# EAGLE design IN-2 tubes (EAGLE 8.6.0)
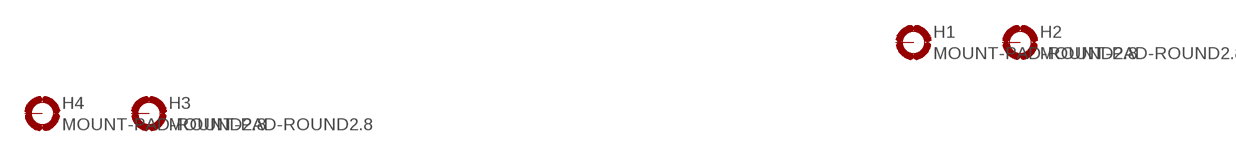
[diagram p0: schematic, sheet 1, part 1 of 2]
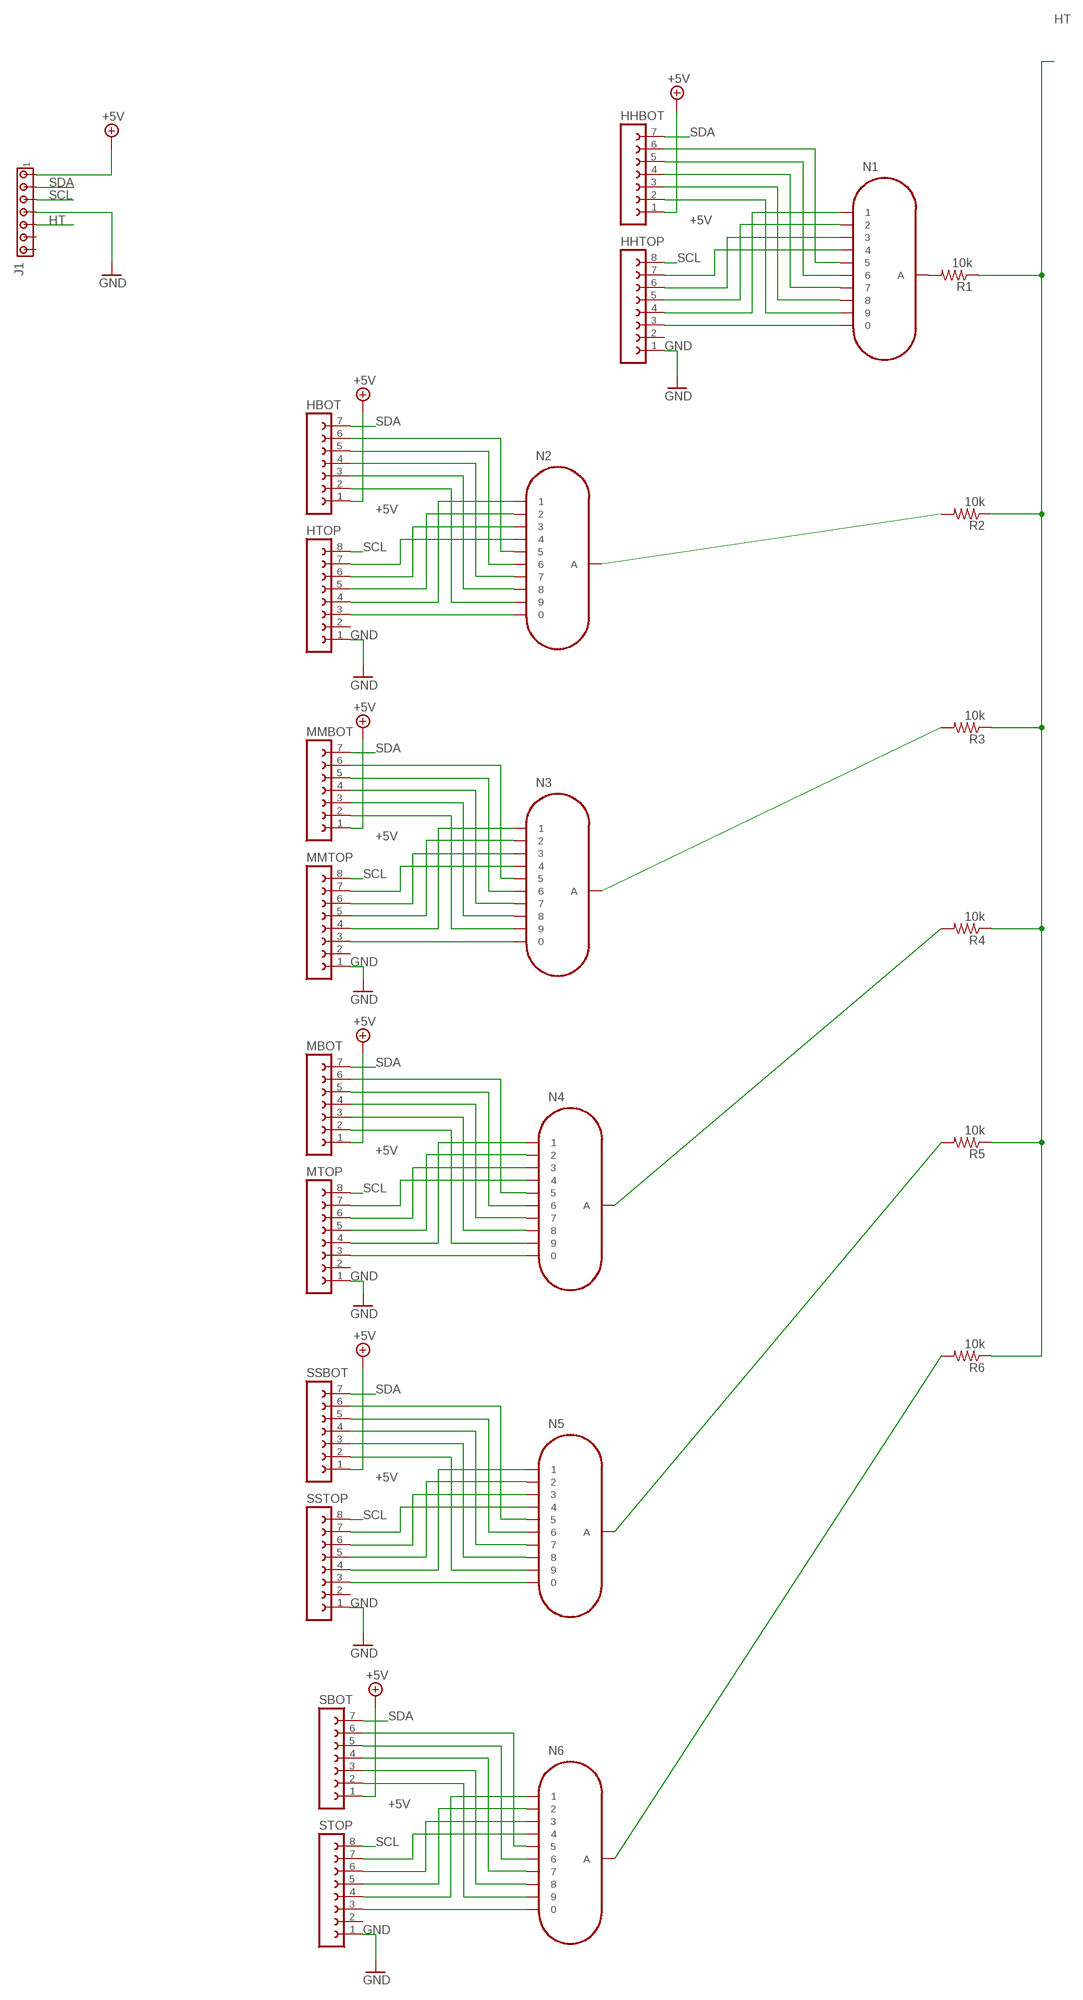
[diagram p1: schematic, sheet 1, part 2 of 2]

## Parts
H1  MOUNT-PAD-ROUND2.8  [2,8-PAD]
H2  MOUNT-PAD-ROUND2.8  [2,8-PAD]
H3  MOUNT-PAD-ROUND2.8  [2,8-PAD]
H4  MOUNT-PAD-ROUND2.8  [2,8-PAD]
HBOT  FE07-1  [FE07]
HHBOT  FE07-1  [FE07]
HHTOP  FE08-1  [FE08]
HTOP  FE08-1  [FE08]
J1  MTA07-100  [10X07MTA]
MBOT  FE07-1  [FE07]
MMBOT  FE07-1  [FE07]
MMTOP  FE08-1  [FE08]
MTOP  FE08-1  [FE08]
N1  IN-2  [IN-8]
N2  IN-2  [IN-8]
N3  IN-2  [IN-8]
N4  IN-2  [IN-8]
N5  IN-2  [IN-8]
N6  IN-2  [IN-8]
R1  10k  R-US_M0805  [M0805]
R2  10k  R-US_M0805  [M0805]
R3  10k  R-US_M0805  [M0805]
R4  10k  R-US_M0805  [M0805]
R5  10k  R-US_M0805  [M0805]
R6  10k  R-US_M0805  [M0805]
SBOT  FE07-1  [FE07]
SSBOT  FE07-1  [FE07]
SSTOP  FE08-1  [FE08]
STOP  FE08-1  [FE08]

## Nets
+5V: HBOT.1 HHBOT.1 J1.1 MBOT.1 MMBOT.1 SBOT.1 SSBOT.1
GND: HHTOP.1 HTOP.1 J1.4 MMTOP.1 MTOP.1 SSTOP.1 STOP.1
HT: J1.5 R1.1 R2.1 R3.1 R4.1 R5.1 R6.1
N$1: HHTOP.3 N1.0
N$2: HHTOP.4 N1.1
N$3: HHTOP.5 N1.2
N$4: HHTOP.6 N1.3
N$5: HHTOP.7 N1.4
N$6: HTOP.3 N2.0
N$7: HTOP.4 N2.1
N$8: HTOP.5 N2.2
N$9: N4.A R4.2
N$10: HTOP.6 N2.3
N$11: HTOP.7 N2.4
N$12: HBOT.6 N2.5
N$13: HBOT.5 N2.6
N$14: N2.A R2.2
N$15: HBOT.4 N2.7
N$16: HBOT.3 N2.8
N$17: N3.A R3.2
N$18: HBOT.2 N2.9
N$19: N6.A R6.2
N$20: N5.A R5.2
N$21: MMTOP.3 N3.0
N$22: N1.A R1.2
N$32: MMTOP.4 N3.1
N$33: MMTOP.5 N3.2
N$34: MMTOP.6 N3.3
N$35: MMTOP.7 N3.4
N$36: MMBOT.6 N3.5
N$37: MMBOT.5 N3.6
N$38: MMBOT.4 N3.7
N$39: MMBOT.3 N3.8
N$40: MMBOT.2 N3.9
N$41: MTOP.3 N4.0
N$42: MTOP.4 N4.1
N$43: MTOP.5 N4.2
N$44: MTOP.6 N4.3
N$45: MTOP.7 N4.4
N$46: MBOT.6 N4.5
N$47: MBOT.5 N4.6
N$48: MBOT.4 N4.7
N$49: MBOT.3 N4.8
N$51: MBOT.2 N4.9
N$52: N5.0 SSTOP.3
N$53: N5.1 SSTOP.4
N$54: N5.2 SSTOP.5
N$55: N5.3 SSTOP.6
N$56: N5.4 SSTOP.7
N$57: N5.5 SSBOT.6
N$58: N5.6 SSBOT.5
N$59: N5.7 SSBOT.4
N$60: N5.8 SSBOT.3
N$61: N5.9 SSBOT.2
N$62: N6.0 STOP.3
N$63: N6.1 STOP.4
N$64: N6.2 STOP.5
N$65: N6.3 STOP.6
N$66: N6.4 STOP.7
N$67: N6.5 SBOT.6
N$68: N6.6 SBOT.5
N$69: N6.7 SBOT.4
N$70: N6.8 SBOT.3
N$71: N6.9 SBOT.2
N$72: HHBOT.6 N1.5
N$73: HHBOT.5 N1.6
N$74: HHBOT.4 N1.7
N$75: HHBOT.3 N1.8
N$76: HHBOT.2 N1.9
SCL: HHTOP.8 HTOP.8 J1.3 MMTOP.8 MTOP.8 SSTOP.8 STOP.8
SDA: HBOT.7 HHBOT.7 J1.2 MBOT.7 MMBOT.7 SBOT.7 SSBOT.7
Unconnected: H1.B2,8(MOUNT) H2.B2,8(MOUNT) H3.B2,8(MOUNT) H4.B2,8(MOUNT) HHTOP.2 HTOP.2 J1.6 J1.7 MMTOP.2 MTOP.2 SSTOP.2 STOP.2

## Library data of the parts
H1-H4 = holes:MOUNT-PAD-ROUND: MOUNTING PAD, round
HBOT HHBOT MBOT MMBOT SBOT SSBOT = con-lsta:FE07-1: FEMALE HEADER; OC_FARNELL: unknown; OC_NEWARK: unknown
HHTOP HTOP MMTOP MTOP SSTOP STOP = con-lsta:FE08-1: FEMALE HEADER; OC_FARNELL: unknown; OC_NEWARK: unknown
J1 = con-amp:MTA07-100: AMP connector
N1-N6 = russian-nixies:IN-2: IN-2: tiny numeric topview nixie tube
R1-R6 = adafruit:R-US_: RESISTOR, American symbol

## Board
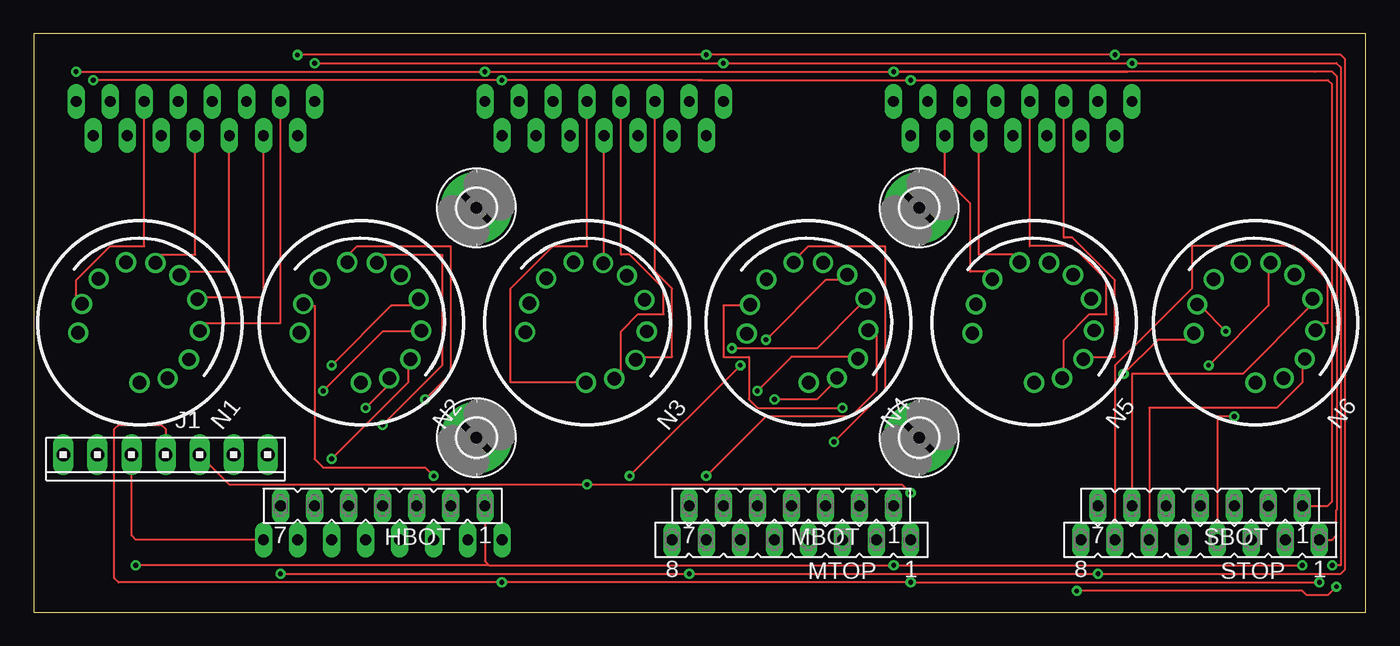
[diagram p2: board, top side]
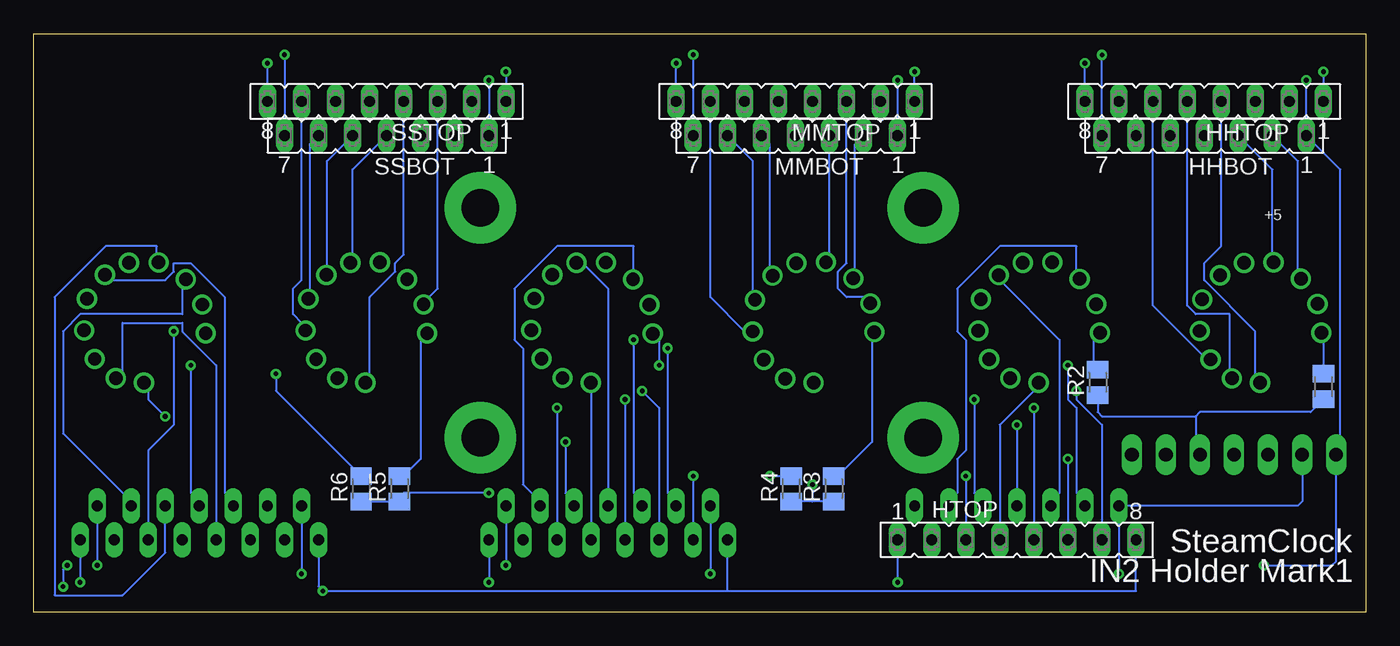
[diagram p3: board, bottom side, seen from below]

Size 99.36 x 43.17 mm. Coordinates in mm from the lower left corner, seen from the top.
Outline: 0,0 99.36,0 99.36,43.17 0,43.17 0,0
Copper layers (1*16): Top 0.035mm / dielectric 1.5mm / Bottom 0.035mm
Design rules "default": minimum track width 6mil, minimum drill 0.35mm, track to track 6mil, track to pad 6mil, pad to pad 6mil, via to via 6mil, smd to smd 6mil, copper to edge 40mil, drill to drill 6mil, minimum pad ring 10mil, minimum via ring 8mil, stop-mask expansion 4mil, vias tented up to drill 0mil, thermal gap 10mil

### Footprints (pad centres in the part's own frame; a part is rotated, then mirrored left to right if it is on the bottom)
2,8-PAD = drill 2.8 pad 5.334: B2,8 0,0
FE07 = drill 0.813 long: 1 -7.62,0; 2 -5.08,0; 3 -2.54,0; 4 0,0; 5 2.54,0; 6 5.08,0; 7 7.62,0
FE08 = drill 0.813 long: 1 -8.89,0; 2 -6.35,0; 3 -3.81,0; 4 -1.27,0; 5 1.27,0; 6 3.81,0; 7 6.35,0; 8 8.89,0
10X07MTA = drill 1.016 long: 1 7.62,0; 2 5.08,0; 3 2.54,0; 4 0,0; 5 -2.54,0; 6 -5.08,0; 7 -7.62,0
IN-8 = drill 1: 0 -4.244,-1.655; 1 2.792,-3.483; 2 4.222,-1.907; 3 4.556,0.189; 4 3.837,2.348; 5 2.203,4.052; 6 0.034,4.603; 7 -1.928,4.186; 8 -3.666,2.83; 9 -4.461,0.584; A -3.101,-3.49
M0805 = smd 1.3 x 1.6: 1 -0.95,0; 2 0.95,0

### Placement (x,y rotation side)
H1  33.02,13.02 0 top
H2  66.04,13.02 0 top
H3  66.04,30.16 0 top
H4  33.02,30.16 0 top
HBOT  26.03,7.94 180 top
HHBOT  12.07,35.56 180 bottom
HHTOP  12.07,38.1 180 bottom
HTOP  26.03,5.4 0 bottom
J1  9.84,11.75 180 top
MBOT  56.52,7.94 180 top
MMBOT  42.55,35.56 180 bottom
MMTOP  42.55,38.1 180 bottom
MTOP  56.52,5.4 180 top
N1  7.94,21.59 320.7 top
N2  24.45,21.59 320.9 top
N3  41.27,21.59 320.2 top
N4  57.78,21.59 321.6 top
N5  74.61,21.59 321.2 top
N6  91.12,21.59 321.3 top
R1  3.18,16.83 90 bottom
R2  20,17.14 90 bottom
R3  39.69,9.21 90 bottom
R4  42.86,9.21 90 bottom
R5  72.07,9.21 90 bottom
R6  74.93,9.21 90 bottom
SBOT  87,7.94 180 top
SSBOT  73.03,35.56 180 bottom
SSTOP  73.03,38.1 180 bottom
STOP  87,5.4 180 top

### Tracks (layer width: path | path; a pad name or v marks a point on that pad's centre or on a via)
+5V  (via drill 0.35)
  Top 0.152: 49.85,39.69 v34.92,39.69 v4.45,39.69 | 49.53,39.69 v65.41,39.69 96.52,39.69 96.84,39.37 96.84,8.25 96.52,7.94 SBOT.1 | HBOT.1 33.66,3.81 33.97,3.49 | 33.97,3.49 v64.14,3.49 v94.61,3.49 | 33.97,3.49 v7.62,3.49
  Bottom 0.152: v34.92,39.69 MMBOT.1 | v65.41,39.69 SSBOT.1 | MBOT.1 v64.14,3.49 | SBOT.1 v94.61,3.49 | v7.62,3.49 2.54,3.49 2.22,3.81 J1.1 1.91,12.06 1.91,33.02 HHBOT.1 v4.45,39.69
GND  (via drill 0.35)
  Top 0.152: v3.18,40.32 v33.66,40.32 81.6,40.32 73.36,40.31 | 73.36,40.31 v64.14,40.32 | v95.89,2.22 v65.41,2.22 v34.92,2.22 6.35,2.22 6.03,2.54 6.03,13.65 6.35,13.97 9.52,13.97 9.84,13.65 J1.4 | 73.36,40.31 95.56,40.31 96.84,40.32 97.17,39.99 97.17,7.63 97.16,7.62 97.16,5.71 96.84,5.4 STOP.1
  Bottom 0.152: v3.18,40.32 HHTOP.1 | v64.14,40.32 SSTOP.1 | MMTOP.1 v33.66,40.32 | MTOP.1 v65.41,2.22 | STOP.1 v95.89,2.22 | HTOP.1 v34.92,2.22
HT  (via drill 0.35)
  Top 0.152: v65.41,8.89 64.77,9.52 v41.27,9.52 14.61,9.52 J1.5
  Bottom 0.152: R1.1 4.13,14.92 12.38,14.92 12.7,14.61 | J1.5 12.7,12.06 12.7,14.61 | R2.1 20,14.92 19.69,14.61 12.7,14.61 | R3.1 41.27,8.26 | 41.27,8.26 R4.1 | R6.1 72.39,8.25 R5.1 71.75,8.89 v65.41,8.89 | v41.27,9.52 41.27,8.26 | 41.27,8.25 41.27,8.26
N$1
  Top 0.152: HHTOP.3 8.25,27.3 5.71,27.3 3.18,24.77 3.18,23.49 N1.0
N$2
  Bottom 0.152: HHTOP.4 10.8,27.3 12.07,26.03 12.07,24.77 8.25,20.95 8.25,17.14 N1.1
N$3
  Bottom 0.152: HHTOP.5 13.34,22.86 12.7,22.22 10.16,22.22 10.16,17.78 N1.2
N$4
  Bottom 0.152: HHTOP.6 15.88,22.86 12.07,19.05 N1.3
N$5
  Top 0.152: HHTOP.7 18.41,21.59 12.7,21.59 N1.4
N$6  (via drill 0.35)
  Top 0.152: v29.84,10.16 29.21,10.79 21.59,10.79 20.95,11.43 20.95,22.86 20.32,22.86 N2.0
  Bottom 0.152: v29.84,10.16 HTOP.3
N$7
  Bottom 0.152: HTOP.4 27.3,13.97 24.77,16.51 N2.1
N$8  (via drill 0.35)
  Top 0.152: v24.77,15.24 26.67,17.14 N2.2
  Bottom 0.152: v24.77,15.24 HTOP.5
N$9  (via drill 0.35)
  Top 0.152: v52.7,18.41 v44.45,10.16
  Bottom 0.152: v44.45,10.16 43.18,10.16 R4.2 | v52.7,18.41 52.7,20.32 N4.A
N$10  (via drill 0.35)
  Top 0.152: v22.23,11.43 27.94,17.14 27.94,18.41 N2.3
  Bottom 0.152: v22.23,11.43 HTOP.6
N$11  (via drill 0.35)
  Top 0.152: v21.59,16.51 26.03,20.95 28.58,20.95 N2.4
  Bottom 0.152: HTOP.7 19.69,13.97 21.59,15.88 v21.59,16.51
N$12  (via drill 0.35)
  Top 0.152: v22.23,18.41 26.67,22.86 28.58,22.86 N2.5
  Bottom 0.152: v22.23,18.41 22.23,15.88 21.59,15.24 21.59,8.89 20.95,8.25 HBOT.6
N$13
  Bottom 0.152: HBOT.5 23.49,8.25 22.86,8.89 22.86,20.32 27.3,24.77 N2.6
N$14
  Bottom 0.152: R2.2 20.32,18.41 20.32,20.32 N2.A
N$15  (via drill 0.35)
  Top 0.152: v26.03,13.97 30.48,18.41 30.48,26.67 26.03,26.67 N2.7
  Bottom 0.152: v26.03,13.97 HBOT.4
N$16  (via drill 0.35)
  Top 0.152: v29.21,15.88 31.12,17.78 31.12,27.3 24.13,27.3 23.49,26.67 N2.8
  Bottom 0.152: v29.21,15.88 29.21,8.89 28.58,8.25 HBOT.3
N$17
  Bottom 0.152: R3.2 39.37,10.16 36.83,12.7 36.83,20.32 N3.A
N$18
  Bottom 0.152: HBOT.2 31.12,8.25 30.48,8.89 30.48,11.43 29.84,12.06 29.84,20.32 30.48,20.95 30.48,24.13 27.3,27.3 21.59,27.3 21.59,25.4 N2.9
N$19  (via drill 0.35)
  Top 0.152: v81.28,17.78 83.82,20.32 86.36,20.32 N6.A
  Bottom 0.152: v81.28,17.78 81.28,16.51 R6.2
N$20
  Bottom 0.152: R5.2 71.75,10.16 70.48,11.43 70.48,20.32 N5.A
N$21
  Bottom 0.152: MMTOP.3 38.73,26.03 39.37,25.4 39.37,24.13 38.73,23.49 37.47,23.49 N3.0
N$22
  Bottom 0.152: R1.2 3.18,20.32 N1.A
N$32
  Top 0.152: MMTOP.4 41.27,27.3 38.73,27.3 35.56,24.13 35.56,17.14 40.64,17.14 N3.1
N$33
  Top 0.152: MMTOP.5 43.81,26.67 44.45,26.67 46.99,24.13 46.99,22.22 45.09,22.22 43.81,20.95 43.81,17.78 N3.2
N$34
  Top 0.152: MMTOP.6 46.35,25.4 47.62,24.13 47.62,19.05 45.09,19.05 N3.3
N$35
  Bottom 0.152: MMTOP.7 48.89,23.49 46.35,20.95 N3.4
N$36
  Bottom 0.152: MMBOT.6 45.72,33.66 45.72,23.49 N3.5
N$37
  Bottom 0.152: MMBOT.5 44.45,34.92 44.45,25.4 N3.6
N$38
  Top 0.152: MMBOT.4 42.55,26.67 N3.7
N$39
  Bottom 0.152: MMBOT.3 40.01,26.67 N3.8
N$40
  Bottom 0.152: MMBOT.2 38.1,34.92 38.1,25.4 N3.9
N$41  (via drill 0.35)
  Top 0.152: v60.33,15.24 53.97,15.24 53.34,15.88 53.34,19.05 51.44,19.05 51.44,22.86 53.34,22.86 N4.0
  Bottom 0.152: v60.33,15.24 MTOP.3
N$42
  Bottom 0.152: MTOP.4 57.78,16.51 N4.1
N$43  (via drill 0.35)
  Top 0.152: v55.25,15.88 58.42,15.88 59.69,17.14 N4.2
  Bottom 0.152: v55.25,15.88 MTOP.5
N$44  (via drill 0.35)
  Top 0.152: v53.97,16.51 56.52,19.05 60.96,19.05 N4.3
  Bottom 0.152: MTOP.6 52.7,15.24 v53.97,16.51
N$45  (via drill 0.35)
  Top 0.152: v50.17,10.16 54.61,14.61 60.96,14.61 62.86,16.51 62.86,20.95 N4.4
  Bottom 0.152: v50.17,10.16 MTOP.7
N$46  (via drill 0.35)
  Top 0.152: v52.07,19.68 58.42,19.68 61.59,22.86 N4.5
  Bottom 0.152: v52.07,19.68 52.07,8.89 51.44,8.25 MBOT.6
N$47  (via drill 0.35)
  Top 0.152: v54.61,20.32 59.06,24.77 60.33,24.77 N4.6
  Bottom 0.152: v54.61,20.32 54.61,8.89 53.97,8.25 MBOT.5
N$48
  Bottom 0.152: MBOT.4 56.52,24.13 58.42,26.03 N4.7
N$49  (via drill 0.35)
  Top 0.152: v59.69,12.7 63.5,16.51 63.5,27.3 57.78,27.3 57.15,26.67 N4.8
  Bottom 0.152: v59.69,12.7 59.69,8.89 59.06,8.25 MBOT.3
N$51
  Bottom 0.152: MBOT.2 61.59,8.25 62.86,9.52 62.86,19.68 63.5,20.32 63.5,24.13 60.33,27.3 54.61,27.3 54.61,25.4 N4.9
N$52
  Bottom 0.152: SSTOP.3 69.22,24.13 69.85,23.49 N5.0
N$53
  Bottom 0.152: SSTOP.4 71.75,26.67 72.39,26.03 72.39,25.4 74.3,23.49 74.3,17.14 N5.1
N$54
  Top 0.152: SSTOP.5 74.3,27.3 77.47,27.3 80.01,24.77 80.01,22.22 78.74,22.22 76.83,20.32 76.83,17.78 N5.2
N$55
  Top 0.152: SSTOP.6 76.83,27.94 77.47,27.94 80.64,24.77 80.64,19.05 78.74,19.05 N5.3
N$56
  Bottom 0.152: SSTOP.7 79.38,24.77 80.01,24.13 80.01,22.22 79.38,21.59 N5.4
N$57
  Bottom 0.152: SSBOT.6 78.74,34.92 78.74,23.49 N5.5
N$58
  Bottom 0.152: SSBOT.5 77.47,33.66 77.47,25.4 N5.6
N$59
  Bottom 0.152: SSBOT.4 75.56,33.02 75.56,26.67 N5.7
N$60
  Top 0.152: SSBOT.3 70.48,26.67 73.03,26.67 N5.8
N$61
  Top 0.152: SSBOT.2 67.94,32.38 69.85,30.48 69.85,25.4 71.12,25.4 N5.9
N$62  (via drill 0.35)
  Top 0.152: v88.9,20.95 87,22.86 N6.0
  Bottom 0.152: STOP.3 90.81,12.06 88.9,13.97 v88.9,20.95
N$63  (via drill 0.35)
  Top 0.152: STOP.4 88.27,14.61 v89.53,14.61
  Bottom 0.152: v89.53,14.61 90.81,15.88 90.81,16.51 N6.1
N$64
  Bottom 0.152: STOP.5 85.72,18.41 88.27,20.95 88.27,21.59 92.71,21.59 92.71,17.78 N6.2
N$65
  Top 0.152: STOP.6 83.19,15.24 92.71,15.24 94.61,17.14 94.61,18.41 N6.3
N$66
  Top 0.152: STOP.7 80.64,18.41 86.36,24.13 86.36,27.3 93.98,27.3 96.52,24.77 96.52,21.59 95.89,21.59 N6.4
N$67
  Top 0.152: SBOT.6 81.92,17.78 90.17,17.78 95.25,22.86 N6.5
N$68
  Bottom 0.152: SBOT.5 84.45,8.25 85.09,8.89 85.09,23.49 87.63,26.03 88.9,26.03 88.9,25.4 89.53,24.77 93.98,24.77 N6.6
N$69  (via drill 0.35)
  Top 0.152: v87.63,18.41 92.08,22.86 92.08,26.03 N6.7
  Bottom 0.152: v87.63,18.41 87.63,8.89 87,8.25 SBOT.4
N$70
  Bottom 0.152: SBOT.3 89.53,4.45 92.71,1.27 97.79,1.27 97.79,23.49 93.98,27.3 90.17,27.3 90.17,26.67 N6.8
N$71
  Bottom 0.152: SBOT.2 92.08,8.25 97.16,13.34 97.16,20.95 95.89,22.22 88.27,22.22 88.27,24.77 N6.9
N$72
  Top 0.152: HHBOT.6 17.15,23.49 12.7,23.49 N1.5
N$73
  Top 0.152: HHBOT.5 14.61,25.4 11.43,25.4 N1.6
N$74
  Top 0.152: HHBOT.4 12.07,26.67 9.52,26.67 N1.7
N$75
  Bottom 0.152: HHBOT.3 6.98,33.02 6.98,26.67 N1.8
N$76
  Bottom 0.152: HHBOT.2 5.08,33.66 5.08,25.4 N1.9
SCL  (via drill 0.35)
  Top 0.152: HTOP.8 7.62,5.4 7.3,5.71 J1.3 | v20.95,40.96 v51.44,40.96 v81.92,40.96 97.16,40.96 97.47,40.64 97.47,3.49 v96.84,3.49 | v97.16,1.9 96.52,1.27 94.93,1.27 94.61,1.59 v77.79,1.59
  Bottom 0.152: STOP.8 78.11,1.9 v77.79,1.59 47.62,1.59 | 47.62,1.59 MTOP.8 47.62,5.71 | 47.62,1.59 17.15,1.59 HTOP.8 | HHTOP.8 v20.95,40.96 | MMTOP.8 v51.44,40.96 | SSTOP.8 v81.92,40.96 | v96.84,3.49 97.16,3.17 v97.16,1.9
SDA  (via drill 0.35)
  Top 0.152: v18.41,2.86 v48.89,2.86 v79.38,2.86 97.47,2.86 97.79,3.17 97.79,41.27 97.47,41.59 v80.64,41.59 v50.17,41.59 20,41.59 v19.69,41.56
  Bottom 0.152: MBOT.7 v48.89,2.86 | SBOT.7 v79.38,2.86 | J1.2 4.76,8.25 5.08,7.94 HBOT.7 v18.41,2.86 | v80.64,41.59 80.64,36.2 80.64,35.87 SSBOT.7 | v50.17,41.59 MMBOT.7 | HHBOT.7 v19.69,41.56

### Text on the board
bNames: +5 | SteamClock | IN2 Holder Mark1